# EAGLE design v1 (EAGLE 9.1.3)
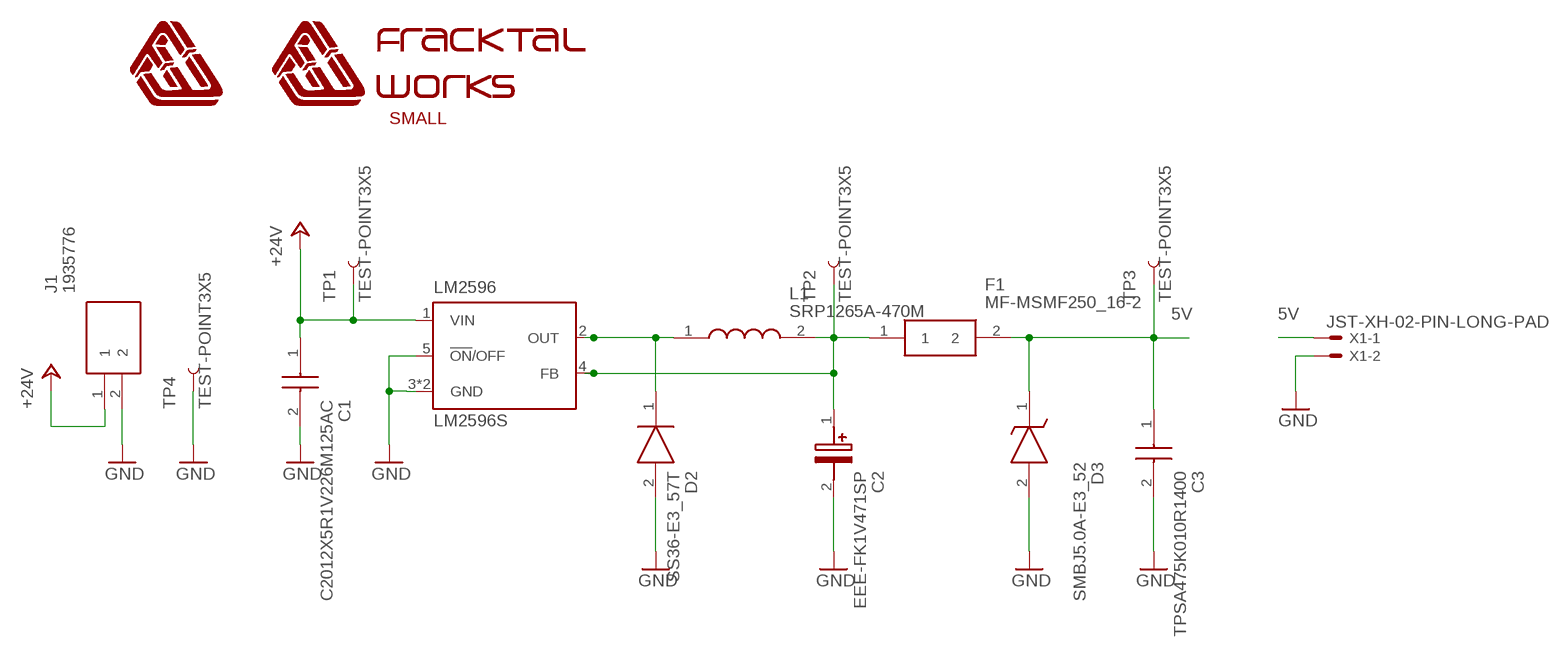
[diagram p0: schematic, sheet 1]

## Parts
C1  C2012X5R1V226M125AC  [CAPC2012X145N]
C2  EEE-FK1V471SP  [CAPAE1030X1050N]
C3  TPSA475K010R1400  [CAPPM3216X180N]
D2  SS36-E3_57T  [DIOM7959X262N]
D3  SMBJ5.0A-E3_52  [DIOM5436X244N]
F1  MF-MSMF250_16-2  [FUSC4632X160N]
J1  1935776  [SHDR2W110P0X500_1X2_1000X900X1]
L1  SRP1265A-470M  [SRP1265A]
LM2596  LM2596S  [LM2596_TO263-5]
TP1  TEST-POINT3X5  [PAD.03X.05]
TP2  TEST-POINT3X5  [PAD.03X.05]
TP3  TEST-POINT3X5  [PAD.03X.05]
TP4  TEST-POINT3X5  [PAD.03X.05]
U$1  FWLOGO  [FWLOGO]
U$2  FWLOGO_TEXT_SMALL  [FWLOGO_TEXT_SMALL]
X1  JST-XH-02-PIN-LONG-PAD  [JST-XH-02-PACKAGE-LONG-PAD]

## Nets
5V: C3.1 D3.1(K) F1.2 TP3.P$1 X1.1
+24V: C1.1 J1.1 LM2596.1(VIN) TP1.P$1
GND: C1.2 C2.2(-) C3.2 D2.2(A) D3.2(A) J1.2 LM2596.3(GND) LM2596.5(!ON!/OFF) LM2596.6(GND) TP4.P$1 X1.2
N$2: D2.1(K) L1.1 LM2596.2(OUT)
N$3: C2.1(+) F1.1 L1.2 LM2596.4(FB) TP2.P$1

## Library data of the parts
C1 = SamacSys_Parts:C2012X5R1V226M125AC: TDK 0805 C 22uF Ceramic Multilayer Capacitor, 35 V dc, +85C, X5R Dielectric, +/-20% Source: Datasheet <https://product.tdk.com/info/en/catalog/datasheets/mlcc_commercial_midvoltage_en.pdf>; DESCRIPTION: TDK 0805 C 22uF Ceramic Multilayer Capacitor, 35 V dc, +85C, X5R Dielectric, +/-20%; HEIGHT: 1.45mm; MANUFACTURER_NAME: TDK; MANUFACTURER_PART_NUMBER: C2012X5R1V226M125AC; MOUSER_PART_NUMBER: 810-C2012X5R1V226MAC; MOUSER_PRICE-STOCK: https://www.mouser.com/Search/Refine.aspx?Keyword=810-C2012X5R1V226MAC; RS_PART_NUMBER: 9159334P; RS_PRICE-STOCK: http://uk.rs-online.com/web/p/products/9159334P
C2 = SamacSys_Parts:EEE-FK1V471SP: Aluminum Electrolytic Capacitors - SMD 35volts 470uF SMD AEC-Q200 Reflow Only Source: Datasheet <https://industrial.panasonic.com/cdbs/www-data/pdf/RDE0000/ABA0000C1251.pdf>; DESCRIPTION: Aluminum Electrolytic Capacitors - SMD 35volts 470uF SMD AEC-Q200 Reflow Only; HEIGHT: 10.5mm; MANUFACTURER_NAME: Panasonic; MANUFACTURER_PART_NUMBER: EEE-FK1V471SP; MOUSER_PART_NUMBER: 667-EEE-FK1V471SP; MOUSER_PRICE-STOCK: https://www.mouser.com/Search/Refine.aspx?Keyword=667-EEE-FK1V471SP
C3 = SamacSys_Parts:TPSA475K010R1400: AVX 4.7 Source: Datasheet <http://datasheets.avx.com/TPS.pdf>; ALLIED_NUMBER: 70002395; ALLIED_PRICE-STOCK: http://www.alliedelec.com/avx-tpsa475k010r1400/70002395/; DESCRIPTION: AVX 4.7; HEIGHT: 1.8mm; MANUFACTURER_NAME: AVX; MANUFACTURER_PART_NUMBER: TPSA475K010R1400; MOUSER_PART_NUMBER: 581-TPSA475K010R1400; MOUSER_PRICE-STOCK: https://www.mouser.com/Search/Refine.aspx?Keyword=581-TPSA475K010R1400; RS_PART_NUMBER: 1366129; RS_PRICE-STOCK: http://uk.rs-online.com/web/p/products/1366129
D2 = SamacSys_Parts:SS36-E3_57T: SS36-E3/57T, Schottky Diode, 3A max, 60V, 2-Pin, SMC Source: Datasheet <https://componentsearchengine.com/Datasheets/2/SS36-E3_57T.pdf>; ALLIED_NUMBER: 70217328; ALLIED_PRICE-STOCK: https://www.alliedelec.com/general-semiconductor-vishay-ss36-e3-57t/70217328/; DESCRIPTION: SS36-E3/57T, Schottky Diode, 3A max, 60V, 2-Pin, SMC; HEIGHT: 2.62mm; MANUFACTURER_NAME: Vishay; MANUFACTURER_PART_NUMBER: SS36-E3/57T; MOUSER_PART_NUMBER: 625-SS36-E3; MOUSER_PRICE-STOCK: https://www.mouser.com/Search/Refine.aspx?Keyword=625-SS36-E3; RS_PART_NUMBER: 7000975P; RS_PRICE-STOCK: http://uk.rs-online.com/web/p/products/7000975P
D3 = SamacSys_Parts:SMBJ5.0A-E3_52: Vishay SMBJ5.0A-E3/52, Uni-Directional TVS Diode, 600W, 2-Pin DO-214AA Source: Datasheet <https://www.vishay.com/docs/88392/smbj.pdf>; ALLIED_NUMBER: 70217303; ALLIED_PRICE-STOCK: https://www.alliedelec.com/generalsemiconductor-vishay-smbj5-0a-e3-52/70217303/; DESCRIPTION: Vishay SMBJ5.0A-E3/52, Uni-Directional TVS Diode, 600W, 2-Pin DO-214AA; HEIGHT: 2.44mm; MANUFACTURER_NAME: Vishay; MANUFACTURER_PART_NUMBER: SMBJ5.0A-E3/52; MOUSER_PART_NUMBER: 625-SMBJ5.0A-E3; MOUSER_PRICE-STOCK: https://www.mouser.com/Search/Refine.aspx?Keyword=625-SMBJ5.0A-E3; RS_PART_NUMBER: 1652507; RS_PRICE-STOCK: http://uk.rs-online.com/web/p/products/1652507
F1 = SamacSys_Parts:MF-MSMF250_16-2: BOURNS - MF-MSMF250/16-2 - FUSE, RESETTABLE PTC, 16V, 2.5A, 1812 Source: Datasheet <https://www.bourns.com/pdfs/mfmsmf.pdf>; DESCRIPTION: BOURNS - MF-MSMF250/16-2 - FUSE, RESETTABLE PTC, 16V, 2.5A, 1812; HEIGHT: 1.6mm; MANUFACTURER_NAME: Bourns; MANUFACTURER_PART_NUMBER: MF-MSMF250/16-2; MOUSER_PART_NUMBER: 652-MF-MSMF250/16-2; MOUSER_PRICE-STOCK: https://www.mouser.com/Search/Refine.aspx?Keyword=652-MF-MSMF250%2F16-2; RS_PART_NUMBER: 6478229P; RS_PRICE-STOCK: http://uk.rs-online.com/web/p/products/6478229P
J1 = SamacSys_Parts:1935776: Fixed Terminal Blocks PT 2.5/ 2-5.0-H g Source: Datasheet <https://www.phoenixcontact.com/online/portal/us?uri=pxc-oc-itemdetail:pid=1935776>; ALLIED_NUMBER: 70055131; ALLIED_PRICE-STOCK: https://www.alliedelec.com/phoenix-contact-1935776/70055131/; DESCRIPTION: Fixed Terminal Blocks PT 2.5/ 2-5.0-H g; HEIGHT: 13.5mm; MANUFACTURER_NAME: Phoenix Contact; MANUFACTURER_PART_NUMBER: 1935776; MOUSER_PART_NUMBER: 651-1935776; MOUSER_PRICE-STOCK: https://www.mouser.com/Search/Refine.aspx?Keyword=651-1935776; RS_PART_NUMBER: 5487272; RS_PRICE-STOCK: http://uk.rs-online.com/web/p/products/5487272
L1 = SamacSys_Parts:SRP1265A-470M: Bourns SRP1265A Series Shielded Wire-wound SMD Inductor with a Carbonyl Powder Core, 47 uH 20% 6.5A Idc Source: Datasheet <https://www.bourns.com/docs/Product-Datasheets/SRP1265A.pdf>; DESCRIPTION: Bourns SRP1265A Series Shielded Wire-wound SMD Inductor with a Carbonyl Powder Core, 47 uH 20% 6.5A Idc; HEIGHT: mm; MANUFACTURER_NAME: Bourns; MANUFACTURER_PART_NUMBER: SRP1265A-470M; MOUSER_PART_NUMBER: 652-SRP1265A-470M; MOUSER_PRICE-STOCK: https://www.mouser.com/Search/Refine.aspx?Keyword=652-SRP1265A-470M; RS_PART_NUMBER: 8193513P; RS_PRICE-STOCK: http://uk.rs-online.com/web/p/products/8193513P
LM2596 = FracktalWorks:LM2596: SIMPLE SWITCHER® Power Converter 150 kHz 3A Step-Down Voltage Regulator Source: http://www.national.com/ds/LM/LM2596.pdf; MF: NATIONAL SEMICONDUCTOR; MPN: LM2596S-ADJ/NOPB; OC_FARNELL: 9494367; OC_NEWARK: 41K3842
TP1-TP4 = SparkFun-Connectors:TEST-POINT: SparkFun Test Points Bare copper test points for troubleshooting or In-Circuit-Testing. These are used by our Production team for verifying production board runs using pogo-pins on test beds. SparkFun Products: SparkFun LSM9DS1 Breakout <https://www.sparkfun.com/products/13284> SparkFun PSOC <https://www.sparkfun.com/products/13714> SparkFun Load Cell Amplifier <https://www.sparkfun.com/products/13879>
U$1 = FracktalWorks:FWLOGO
U$2 = FracktalWorks:FWLOGO_TEXT_SMALL
X1 = Rembrandt:JST-XH-02-PIN: JST XH Connector 2 Pin Wire to board connector. Pitch: 2,54 mm, (0.100") Number of pins: 2 Created by Rembrandt Electronics www.rembrandtelectronics.com

## Board
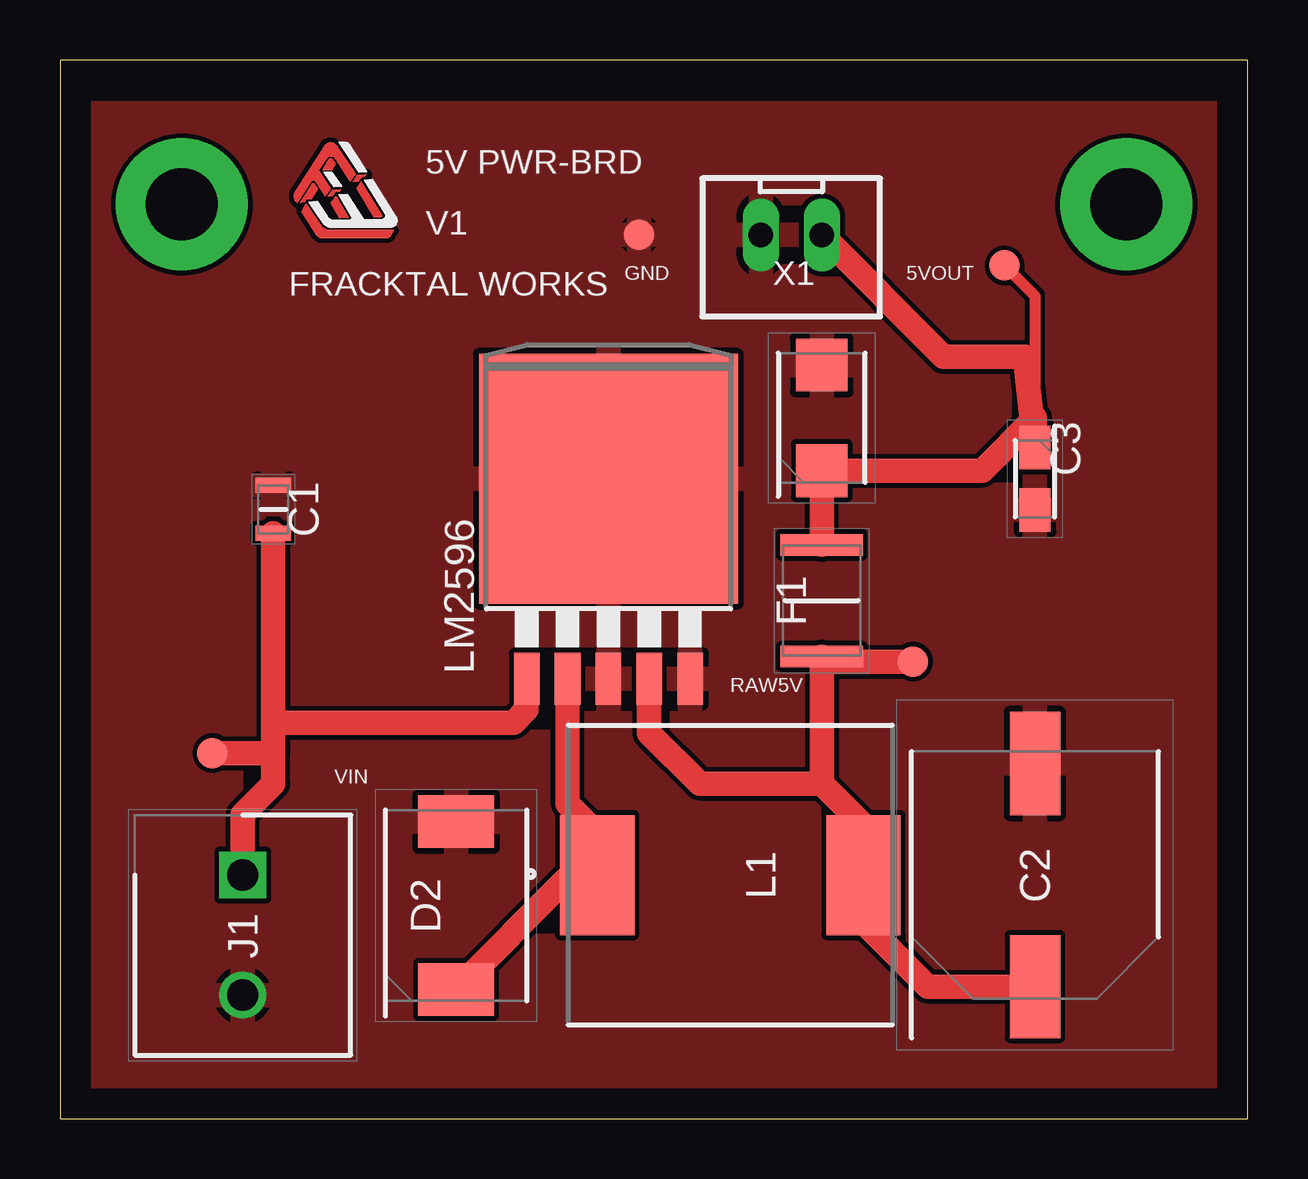
[diagram p1: board, top side]
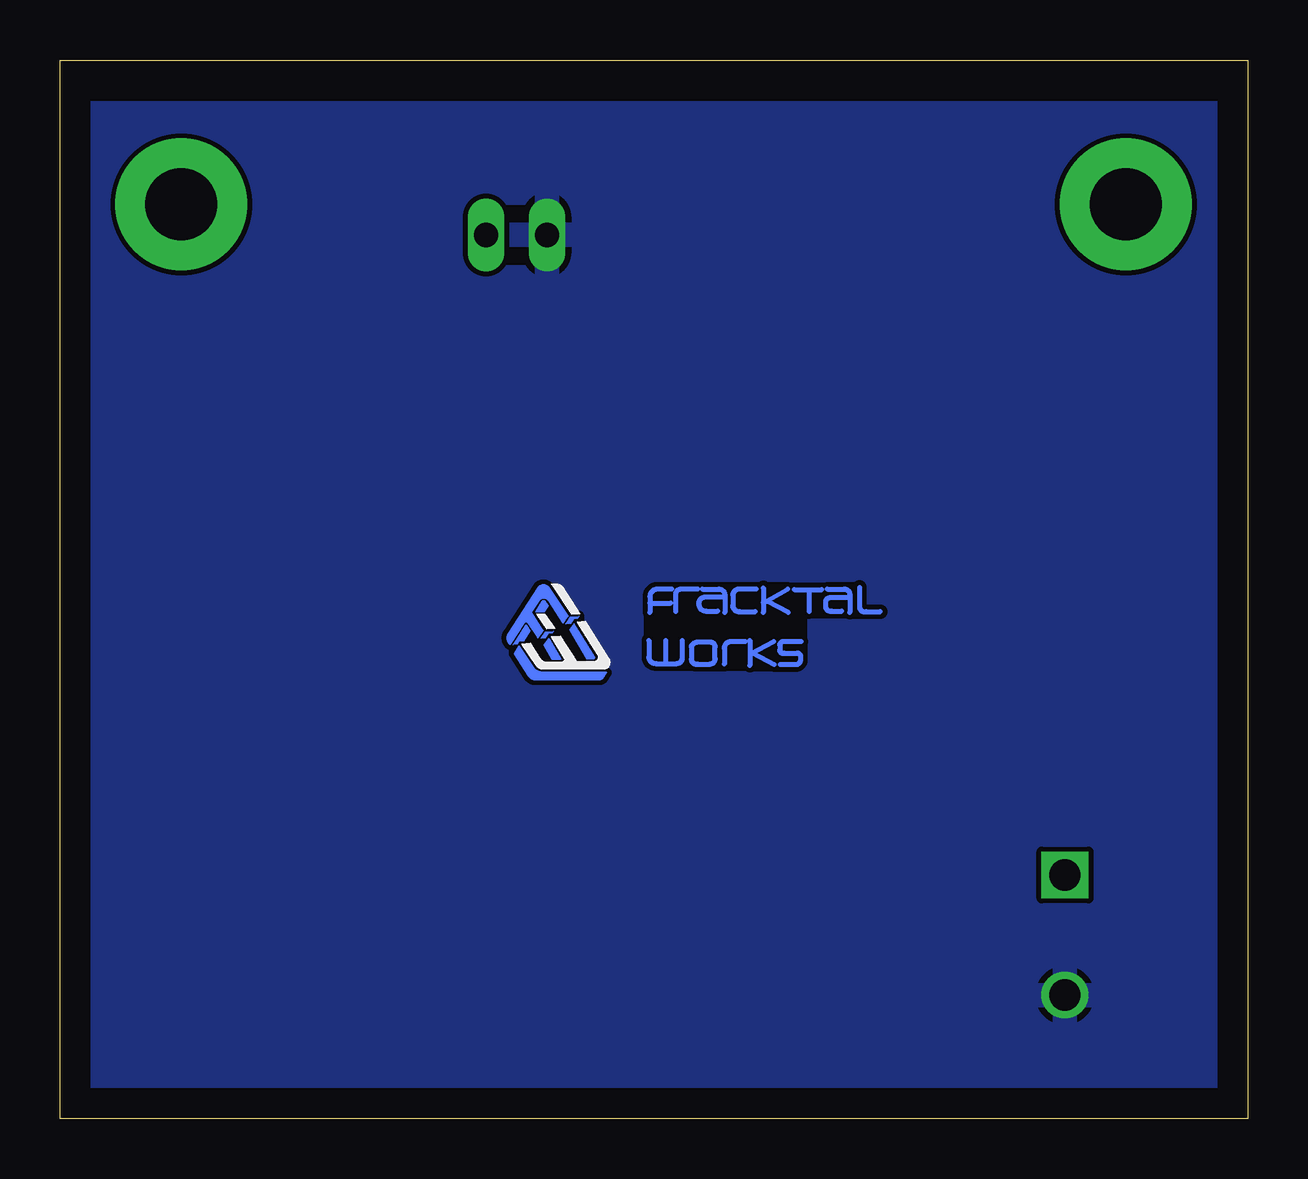
[diagram p2: board, bottom side, seen from below]

Size 49.51 x 44.12 mm. Coordinates in mm from the lower left corner, seen from the top.
Outline: 0,0 49.51,0 49.51,44.12 0,44.12 0,0
Copper layers (1*16): Top 0.035mm / dielectric 1.5mm / Bottom 0.035mm
Design rules "LionCircuits": minimum track width 8mil, minimum drill 0.35mm, track to track 8mil, track to pad 8mil, pad to pad 8mil, via to via 8mil, smd to smd 8mil, copper to edge 50mil, drill to drill 10mil, minimum pad ring 10mil, minimum via ring 8mil, stop-mask expansion 4mil, vias tented up to drill 0mil, thermal gap 10mil

### Footprints (pad centres in the part's own frame; a part is rotated, then mirrored left to right if it is on the bottom)
CAPC2012X145N = smd 0.62 x 1.47: 1 -1,0; 2 1,0
CAPAE1030X1050N = smd 4.3 x 2.1: 1 -4.65,0; 2 4.65,0
CAPPM3216X180N = smd 1.8 x 1.3: 1 -1.3,0; 2 1.3,0
DIOM7959X262N = smd 2.2 x 3.15: 1 -3.5,0; 2 3.5,0
DIOM5436X244N = smd 2.2 x 2.15: 1 -2.2,0; 2 2.2,0
FUSC4632X160N = smd 0.89 x 3.43: 1 -2.325,0; 2 2.325,0
SHDR2W110P0X500_1X2_1000X900X1 = drill 1.3 pad 1.95 square: 1 0,0 | drill 1.3 pad 1.95: 2 5,0
SRP1265A = smd 3.1 x 5: 1 -5.55,0; 2 5.55,0
LM2596_TO263-5 = smd 1.067 x 2.159: 1 -3.404,-5.791; 2 -1.702,-5.791; 3 0,-5.791; 4 1.702,-5.791; 5 3.404,-5.791 | smd 10.8 x 10.41: 6 0,2.54
PAD.03X.05 = smd 1.27 x 1.27: P$1 0,0
JST-XH-02-PACKAGE-LONG-PAD = drill 1.016 long: 1 -1.27,0; 2 1.27,0

### Placement (x,y rotation side)
C1  8.89,25.4 90 top
C2  40.64,10.16 90 top
C3  40.64,26.67 270 top
D2  16.51,8.89 90 top
D3  31.75,29.21 90 top
F1  31.75,21.59 90 top
J1  7.62,10.16 270 top
L1  27.94,10.16 0 top
LM2596  22.86,24.13 0 top
TP1  6.35,15.24 0 top
TP2  35.56,19.05 0 top
TP3  39.37,35.56 0 top
TP4  24.13,36.83 0 top
U$1  8.26,35.56 0 top
U$2  31.11,17.14 0 bottom
X1  30.48,36.83 180 top

### Tracks (layer width: path | path; a pad name or v marks a point on that pad's centre or on a via)
5V
  Top 0.457: TP3.P$1 40.64,34.29 C3.1
  Top 1.016: F1.2 D3.1 38.44,27.01 40.64,29.21 C3.1 40.21,31.75 36.83,31.75 X1.1
+24V
  Top 1.016: LM2596.1 19.46,17.07 18.9,16.51 8.89,16.51 | C1.1 8.89,16.51 | 8.89,16.51 8.89,15.24 | J1.1 7.62,12.7 8.89,13.97 8.89,15.24 | TP1.P$1 8.89,15.24
GND
  pour Top: 1.27,1.27 1.27,41.91 48.26,41.91 48.26,1.27
  pour Bottom: 1.27,41.91 1.27,1.27 48.26,1.27 48.26,41.91
N$2
  Top 1.016: LM2596.2 21.16,13.13 22.39,11.9 L1.1 22.39,10 21.12,10 D2.1
N$3
  Top 1.016: C2.1 36.83,5.51 36.17,5.51 33.49,8.19 L1.2 33.49,12.23 31.75,13.97 | 31.75,13.97 F1.1 31.96,19.05 TP2.P$1 | LM2596.4 24.56,16.08 26.67,13.97 31.75,13.97
N$4  (via drill 3 pad 5.5)
  other vias: 5.08,38.1
N$5  (via drill 3 pad 5.5)
  other vias: 44.45,38.1

### Text on the board
tPlace: V1 | GND | 5VOUT | FRACKTAL WORKS | RAW5V | VIN
tNames: 5V PWR-BRD